# EAGLE design fan7385_breakout (EAGLE 6.4)
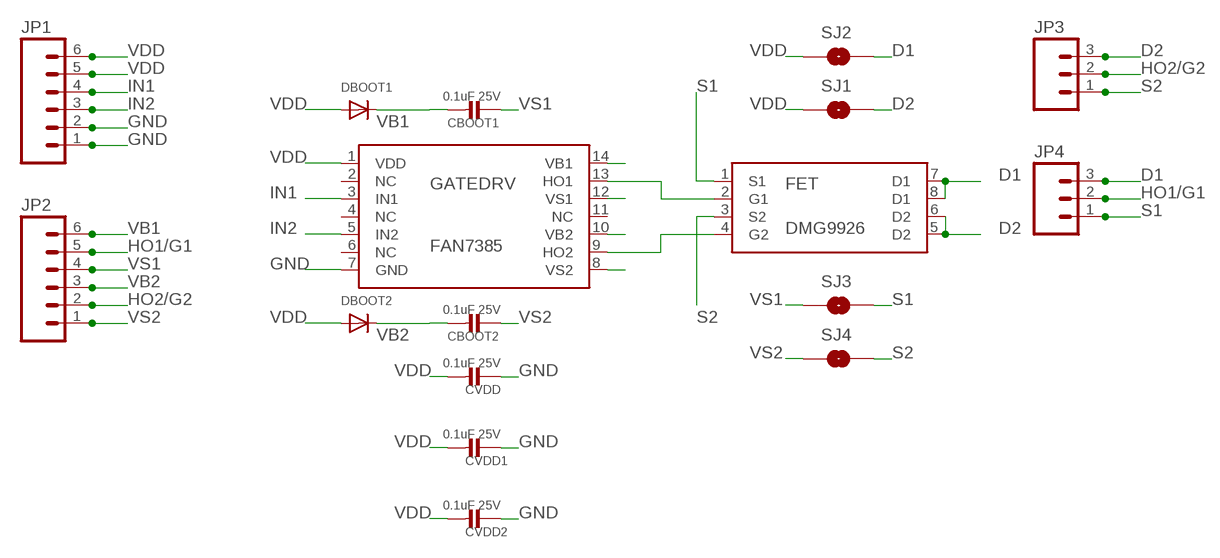
[diagram p0: schematic, sheet 1]

## Parts
CBOOT1  0.1uF 25V  CAP_CERAMIC0805  [0805]
CBOOT2  0.1uF 25V  CAP_CERAMIC0805  [0805]
CVDD  0.1uF 25V  CAP_CERAMIC0805  [0805]
CVDD1  0.1uF 25V  CAP_CERAMIC0805  [0805]
CVDD2  0.1uF 25V  CAP_CERAMIC0805  [0805]
DBOOT1  DIODESOT23_WIDE  [SOT23-WIDE]
DBOOT2  DIODESOT23_WIDE  [SOT23-WIDE]
FET  DMG9926  [SOP8-L]
GATEDRV  FAN7385  [SOT14]
JP1  M06SIP  [1X06]
JP2  M06SIP  [1X06]
JP3  M03PTH  [1X03]
JP4  M03PTH  [1X03]
SJ1  SOLDERJUMPERNO  [SJ_2S-NO]
SJ2  SOLDERJUMPERNO  [SJ_2S-NO]
SJ3  SOLDERJUMPERTRACE  [SJ_2S-TRACE]
SJ4  SOLDERJUMPERTRACE  [SJ_2S-TRACE]

## Nets
D1 [high-power]: FET.7(D1) FET.8(D1) JP4.3 SJ2.2
D2 [high-power]: FET.5(D2) FET.6(D2) JP3.3 SJ1.2
GND [high-power]: CVDD1.1 CVDD2.1 CVDD.1 GATEDRV.7(GND) JP1.1 JP1.2
HO1/G1: FET.2(G1) GATEDRV.13(HO1) JP2.5 JP4.2
HO2/G2: FET.4(G2) GATEDRV.9(HO2) JP2.2 JP3.2
IN1: GATEDRV.3(IN1) JP1.4
IN2: GATEDRV.5(IN2) JP1.3
S1 [high-power]: FET.1(S1) JP4.1 SJ3.2
S2 [high-power]: FET.3(S2) JP3.1 SJ4.2
VB1: CBOOT1.2 DBOOT1.3(C) GATEDRV.14(VB1) JP2.6
VB2: CBOOT2.2 DBOOT2.3(C) GATEDRV.10(VB2) JP2.3
VDD [high-power]: CVDD1.2 CVDD2.2 CVDD.2 DBOOT1.1(A) DBOOT2.1(A) GATEDRV.1(VDD) JP1.5 JP1.6 SJ1.1 SJ2.1
VS1: CBOOT1.1 GATEDRV.12(VS1) JP2.4 SJ3.1
VS2: CBOOT2.1 GATEDRV.8(VS2) JP2.1 SJ4.1
Unconnected: GATEDRV.2(NC) GATEDRV.4(NC) GATEDRV.6(NC) GATEDRV.11(NC)

## Library data of the parts
CBOOT1 CBOOT2 CVDD CVDD1 CVDD2 = microbuilder:CAP_CERAMIC: Ceramic Capacitors 0402 - 0402 Surface Mount Capacitors 16pF 50V 5% [Digikey: 445-4899-2-ND] 18pF 50V 5% [Digikey: 490-1281-2-ND] 22pF 50V 5% [Digikey: 490-1283-2-ND] 68pF 50V 5% [Digikey: 490-1289-2-ND] 0.1uF 10V 10% [Digikey: 490-1318-2-ND] 1.0uF 6.3V 10% [Digikey: 490-1320-2-ND] 0603 - 0603 Surface Mount Capacitors 16 pF 50V 5% [Digikey: 445-5051-2-ND] 22 pF 50V [Digikey: PCC220ACVTR-ND] 33 pF 50V 5% [Digikey: 490-1415-1-ND] 56pF 50V 5% [Digikey: 490-1421-1-ND] 220pF 50V 5% [Digikey: 445-1285-1-ND] 680 pF 50V 2200 pF 50V 5% C0G [Digikey: 445-1297-1-ND] 5600 pF 100V 5% X7R [Digikey: 478-3711-1-ND] 0.1 µF 25V 10% [Digikey: PCC2277TR-ND] 0.22 µF 16V 10% X7R [Digikey: 445-1318-1-ND] 1.0 µF 25V 10% [Digikey: 445-5146-2-ND] 0603 - RF Specific 3pF 250V +/-0.1pF RF [Digikey: 712-1347-1-ND] 18 pF 250V 5% [Digikey: 478-3505-1-ND or 712-1322-1-ND] 56 pF 250V 5% C0G RF [Digikey: 490-4867-1-ND] 68 pF 250V RF [Digikey: 490-4868-1-ND] 0805 - 0805 Surface Mount Capacitors 220 pF 250V 2% RF Ceramic Capacitor [Digikey: 712-1398-1-ND] 1000 pF 50V 2% NP0 Ceramic Capacitor [Digikey: 478-3760-1-ND] 0.1 µF 25V 10% Ceramic Capacitor [Digikey: PCC1828TR-ND] 1.0 µF 16V 10% Ceramic Capacitor[Digikey: 490-1691-2-ND] 10.0 µF 10V 10% Ceramic Capacitor[Digikey: 709-1228-1-ND] 10.0 uF 16V 10% Ceramic Capacitor [Digikey: 478-5165-2-ND] 47 uF 6.3V 20% Ceramic Capacitor [Digikey: 587-1779-1-ND or 399-5506-1-ND] 1206 - 1206 Surface Mount Capacitors 47uF 10V 20% Ceramic Capacitor [Digikey: 490-5528-1-ND or 399-5508-1-ND or 445-6010-1-ND] 100uF 6.3V -20%, +80% Y5V Ceramic Capacitor (Digikey: 490-4512-1-ND, Mouser: 81-GRM31CF50J107ZE1L)
DBOOT1 DBOOT2 = microbuilder:DIODE: Diode SMA Model Volts Amps Type Vf Vr Digikey # Notes SSA34-E3 40V 3A Schottky 480mV @ 3A 200uA @ 40V SSA34-E3/61TGITR-ND CDBA120-G 20V 1A Schottky 500mV @ 1A 500uA @ 20V 641-1014-6-ND REEL MBRA210 10V 2A Schottky 350mV @ 2A 700uA @ 10V MBRA210LT3 SOD-123 Model Volts Amps Type Vf Vr Order # Notes BAT54T1G 30V 200mA Schottky 800mV @ 200mA 2uA @ 25V BAT54T1GOSTR-ND B0530W 30V 500mA Schottky 430mV @ 500mA 130uA @ 30V B0530W-FDICT-ND REEL MBR120 1A 20V Schottky 340mV @ 1A MBR120VLSFT1GOSCT-ND SOD-323 Model Volts Amps Type Vf Vr Order # Notes PMEG2005EJ 20V 500mA Schottky 355mV @ 500mA 568-4110-1-ND ZLLS410 10V 570mA Schottky 380mV @ 570mA ZLLS410CT-ND 1N4148WS 75V 150mA Silicon/Simple 1V 1N4148WSFSCT-ND REEL SOD-523 Model Volts Amps Type Vf Vr Order # Notes BAT54XV2 30V 200mA Schottky 0.8V @ 100mA BAT54XV2CT-ND TB751S 30V 30mA Schottky RB751S-40TE61CT-ND SOT23-R/W (R = Solder Paste/Reflow Ovens, W = Hand-Soldering) Model Volts Amps Type Vf Vr Order # Notes BAT54FILM 40V 300mA Schottky 497-7162-1-ND
FET = DMG9926:DMG9926
GATEDRV = fan7385:FAN7385: edit this description Auto generated by make-symbol-device-package-bsdl.ulp Rev. 43 Source:
JP1 JP2 = SparkFun-Connectors:M06: Header 6 Standard 6-pin 0.1" header. Use with straight break away headers (SKU : PRT-00116), right angle break away headers (PRT-00553), swiss pins (PRT-00743), machine pins (PRT-00117), and female headers (PRT-00115). Molex polarized connector foot print use with SKU : PRT-08094 with associated crimp pins and housings. NOTES ON THE VARIANTS LOCK and LOCK_LONGPADS... This footprint was designed to help hold the alignment of a through-hole component (i.e. 6-pin header) while soldering it into place. You may notice that each hole has been shifted either up or down by 0.005 of an inch from it's more standard position (which is a perfectly straight line). This slight alteration caused the pins (the squares in the middle) to touch the edges of the holes. Because they are alternating, it causes a "brace" to hold the component in place. 0.005 has proven to be the perfect amount of "off-center" position when using our standard breakaway headers. Although looks a little odd when you look at the bare footprint, once you have a header in there, the alteration is very hard to notice. Also, if you push a header all the way into place, it is covered up entirely on the bottom side. This idea of altering the position of holes to aid alignment will be further integrated into the Sparkfun Library for other footprints. It can help hold any component with 3 or more connection pins.
JP3 JP4 = SparkFun-Connectors:M03: Header 3 Standard 3-pin 0.1" header. Use with straight break away headers (SKU : PRT-00116), right angle break away headers (PRT-00553), swiss pins (PRT-00743), machine pins (PRT-00117), and female headers (PRT-00115). Molex polarized connector foot print use with SKU : PRT-08232 with associated crimp pins and housings.
SJ1-SJ4 = SparkFun-Passives:SOLDERJUMPER: Solder Jumper Standard SMD solder jumper. Used to automate production. Two varients : Normally Open and Normally Closed are the same, but have different paste layers. NC will have a large amount of paste and should jumper during reflow.

## Net classes
1 power: width 0.254 mm
2 high-power: width 0.508 mm

## Board
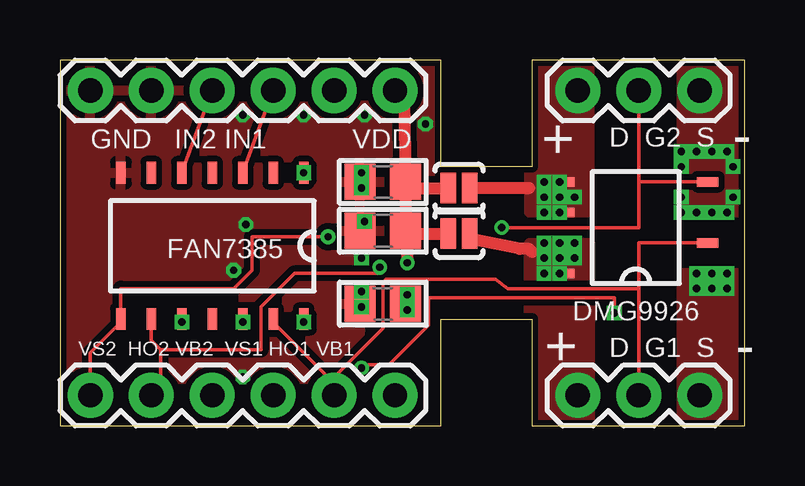
[diagram p1: board, top side]
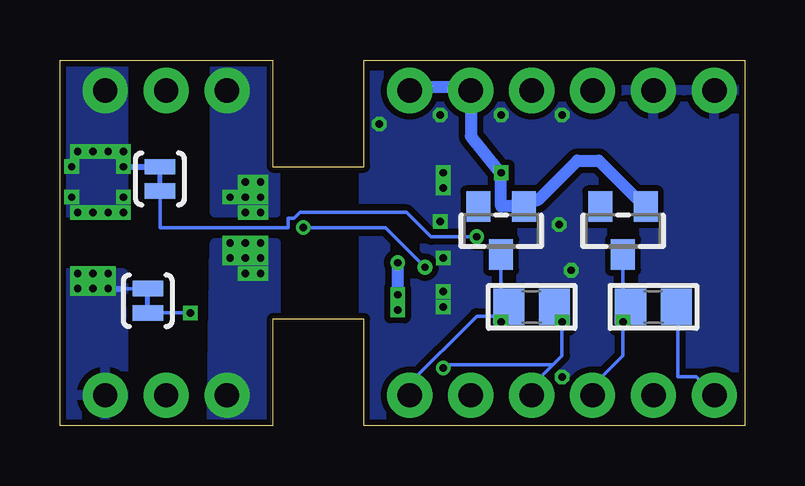
[diagram p2: board, bottom side, seen from below]

Size 28.55 x 15.24 mm. Coordinates in mm from the lower left corner, seen from the top.
Outline: 0,0 15.88,0 15.88,4.45 19.68,4.45 19.68,0 28.55,0 28.55,15.24 19.68,15.24 19.68,10.79 15.88,10.79 15.88,15.24 0,15.24 0,0
Copper layers (1*16): Top 0.035mm / dielectric 1.5mm / Bottom 0.035mm
Design rules "Fusion_eagle_rule_v1.1": minimum track width 6mil, minimum drill 12mil, track to track 6mil, track to pad 6mil, pad to pad 6mil, via to via 6mil, smd to smd 0mil, copper to edge 10mil, drill to drill 10mil, minimum pad ring 10mil, minimum via ring 6mil, stop-mask expansion 2mil, vias tented up to drill 100mil, thermal gap 10mil

### Footprints (pad centres in the part's own frame; a part is rotated, then mirrored left to right if it is on the bottom)
0805 = smd 1.3 x 1.5: 1 -0.95,0; 2 0.95,0
SOT23-WIDE = smd 1 x 1.27: 1 -0.95,-1; 2 0.95,-1; 3 0,1
SOP8-L = smd 0.9 x 0.4: 1 -3,1.905; 2 -3,0.635; 3 -3,-0.635; 4 -3,-1.905; 5 3,-1.905; 6 3,-0.635; 7 3,0.635; 8 3,1.905
SOT14 = smd 0.9 x 0.4: 1 -3.05,3.81; 2 -3.05,2.54; 3 -3.05,1.27; 4 -3.05,0; 5 -3.05,-1.27; 6 -3.05,-2.54; 7 -3.05,-3.81; 8 3.05,-3.81; 9 3.05,-2.54; 10 3.05,-1.27; 11 3.05,0; 12 3.05,1.27; 13 3.05,2.54; 14 3.05,3.81
1X06 = drill 1.016 pad 1.88: 1 0,0; 2 2.54,0; 3 5.08,0; 4 7.62,0; 5 10.16,0; 6 12.7,0
1X03 = drill 1.016 pad 1.88: 1 0,0; 2 2.54,0; 3 5.08,0
SJ_2S-NO = smd 0.635 x 1.27: 1 -0.45,0; 2 0.45,0
SJ_2S-TRACE = smd 0.635 x 1.27: 1 -0.508,0; 2 0.508,0

### Placement (x,y rotation side)
CBOOT1  8.89,4.95 180 bottom
CBOOT2  3.81,4.95 180 bottom
CVDD  13.46,10.16 0 top
CVDD1  13.46,8.13 0 top
CVDD2  13.46,5.08 0 top
DBOOT1  10.16,8.13 180 bottom
DBOOT2  5.08,8.13 180 bottom
FET  24,8.26 180 top
GATEDRV  6.35,7.49 270 top
JP1  1.27,13.97 0 top
JP2  1.27,1.27 0 top
JP3  26.67,13.97 180 top
JP4  26.67,1.27 180 top
SJ1  16.64,9.91 0 top
SJ2  16.64,8 0 top
SJ3  24.89,5.21 90 bottom
SJ4  24.38,10.29 90 bottom

### Tracks (layer width: path | path; a pad name or v marks a point on that pad's centre or on a via)
D1  (via drill 0.3)
  Top 0.508: SJ2.2 17.27,7.75 19.18,7.37 19.56,7.37 19.68,7.24
  other vias: 20.19,7.62 20.19,6.99 20.83,6.99 21.46,6.99 21.46,7.62 20.83,7.62 20.83,6.35 20.19,6.35
  pour Top (isolate 0.254, no thermals): 22.1,7.62 22.1,-0.13 19.56,-0.13 19.56,7.62
  pour Bottom (isolate 0.254, no thermals): 19.56,7.62 19.56,-0.13 22.23,-0.13 22.1,7.62
D2  (via drill 0.3)
  Top 0.508: SJ1.2 17.14,9.91 19.43,9.91 19.56,9.91
  other vias: 20.83,9.53 20.83,8.89 20.83,10.16 21.46,9.53 20.19,9.53 20.19,10.16 20.19,8.89
  pour Top (isolate 0.254, no thermals): 22.1,8.89 22.1,15.24 19.56,15.24 19.56,8.89
  pour Bottom (isolate 0.254, no thermals): 19.56,8.89 19.56,15.24 22.1,15.24 22.1,8.89
GND  (via drill 0.3)
  other vias: 12.57,10.54 12.57,9.91 12.7,8.51 7.62,12.95 7.75,8.38 12.57,5.59 12.57,4.95 12.57,6.99 10.16,12.95 15.24,12.57 12.7,12.95 7.24,6.48 7.62,2.03
  pour Bottom (isolate 0.254): -0.64,14.61 -0.64,-1.27 15.88,-1.27 15.88,14.61
  pour Top (isolate 0.254): -1.27,15.88 -1.27,-2.54 16.51,-2.54 16.51,15.88
HO1/G1
  Top 0.152: 11.3,1.91 11.43,1.78 JP2.5 11.3,1.91 | 11.3,1.91 8.89,4.32 GATEDRV.13 | JP4.2 24.13,5.71 | 24.13,5.71 24.13,7.62 26.92,7.62 FET.2 | 11.3,1.91 13.46,4.06 13.46,5.97 13.59,6.1 18.03,6.1 18.16,6.1 18.67,5.71 24.13,5.71
HO2/G2  (via drill 0.3)
  Top 0.152: 4.19,3.17 3.81,3.56 3.81,4.32 GATEDRV.9 | 4.19,3.17 4.19,1.52 JP2.2 | 24.13,10.16 26.92,10.16 FET.4 | JP3.2 24.13,10.16 | 24.13,10.16 24.13,8.26 19.05,8.26 v18.41,8.26 | 4.19,3.17 8.38,3.17 8.38,4.95 9.78,6.35 13.34,6.35 v13.34,6.6
  Bottom 0.152: v13.34,6.6 14.99,8.26 v18.41,8.26
IN1
  Top 0.152: JP1.4 GATEDRV.3
IN2
  Top 0.152: JP1.3 GATEDRV.5
S1  (via drill 0.3)
  Bottom 0.152: SJ3.2 v26.54,5.71
  Bottom 0.254: v26.54,5.71 25.91,5.71
  other vias: 26.54,6.35 27.18,6.35 27.81,6.35 27.81,5.71 27.18,5.71
  pour Top (isolate 0.254, no thermals): 28.45,0 28.45,6.35 25.91,6.35 25.91,0
  pour Bottom (isolate 0.254): 25.91,0 25.91,6.35 28.45,6.35 28.57,0.13
S2  (via drill 0.3)
  Bottom 0.254: v25.91,10.79 SJ4.2
  other vias: 26.54,8.89 27.18,8.89 27.81,8.89 25.91,9.53 28.07,9.53 25.91,8.89 28.07,10.79 27.81,11.43 27.18,11.43 26.54,11.43 25.91,11.43
  pour Top (isolate 0.254, no thermals): 28.45,8.89 28.45,15.24 25.91,15.24 25.91,8.89
  pour Bottom (isolate 0.254, no thermals): 25.91,8.89 25.91,15.24 28.45,15.24 28.45,8.89
VB1  (via drill 0.3)
  Top 0.152: v10.16,4.32 GATEDRV.14
  Bottom 0.152: 10.16,4.95 10.16,4.57 | 10.16,4.57 v10.16,4.32 10.16,4.57 | 10.16,4.95 9.91,4.95 CBOOT1.2 10.16,4.95 | 10.16,4.95 10.16,7.11 DBOOT1.3 | 10.16,4.57 11.18,4.57 14.1,1.65 JP2.6
VB2  (via drill 0.3)
  Top 0.152: v5.08,4.32 GATEDRV.10
  Bottom 0.152: 5.08,4.95 v5.08,4.32 5.08,2.92 6.48,1.52 JP2.3 | 5.08,4.95 4.83,4.95 CBOOT2.2 5.08,4.95 | 5.08,4.95 5.08,7.11 DBOOT2.3
VDD  (via drill 0.3)
  Top 0.508: JP1.6 14.35,13.97 14.35,13.59 CVDD.2 | CVDD.2 CVDD1.2 | GATEDRV.1 | 14.61,9.91 CVDD.2 | CVDD1.2 14.48,8.13 v14.48,6.79 | v14.48,5.46 14.41,5.46 CVDD2.2 14.41,4.83 v14.48,4.83 | SJ2.1 16.13,8 14.61,8 CVDD1.2 | SJ1.1 16.13,9.91 14.86,9.91 CVDD.2
  Bottom 0.508: DBOOT2.1 4.19,9.14 6.1,11.05 6.99,11.05 8.64,9.4 9.27,9.4 DBOOT1.1 9.27,9.14 10.16,9.14 GATEDRV.1 10.29,10.67 11.43,12.06 11.43,13.84 JP1.5 11.43,14.1 13.97,14.1 JP1.6 | v14.48,6.79 14.48,5.71 v14.48,5.46
  other vias: 10.16,10.54
VS1  (via drill 0.3)
  Top 0.152: v7.62,4.32 GATEDRV.12 | v23.11,4.7 23.11,5.33 19.18,5.33 15.37,5.33 15.37,4.19 13.72,2.54 12.57,2.54 v12.57,2.41
  Bottom 0.152: CBOOT1.1 7.87,4.95 7.62,4.95 v7.62,4.32 7.62,2.92 8,2.54 | 8,2.54 9.02,1.52 JP2.4 | SJ3.1 v23.11,4.7 | v12.57,2.41 12.45,2.54 8,2.54
VS2  (via drill 0.3)
  Top 0.152: JP2.1 1.27,3.05 2.54,4.32 GATEDRV.8 2.54,5.71 7.24,5.71 8,6.48 8,7.87 v11.18,7.87
  Bottom 0.152: JP2.1 2.03,2.03 2.79,2.03 2.79,4.95 CBOOT2.1 | SJ4.1 24.38,8.26 19.05,8.26 19.05,8.64 18.8,8.64 18.54,8.89 14.1,8.89 13.08,7.87 v11.18,7.87

### Text on the board
tNames: + | - | GND IN2 IN1 | VDD | D G2 S | FAN7385 | DMG9926 | + | D G1 S | - | VS2 HO2 VB2 VS1 HO1 VB1